# Altium schematic sheet 04_SCAN.SchDoc
size A4; PageSetup: Record=PageOptions|CenterHorizontal=True|CenterVertical=True|PrintScale=0.97|XCorrection=1.00|YCorrection=1.00|PrintKind=0|BorderSize=5000000|LeftOffset=0|BottomOffset=0|Orientation=2|PaperLength=1000|PaperWidth=1000|Scale=100|PaperSource=7|PrintQuality=-4|MediaType=1|DitherType=10|PaperKind=A4|PrintScaleMode=1
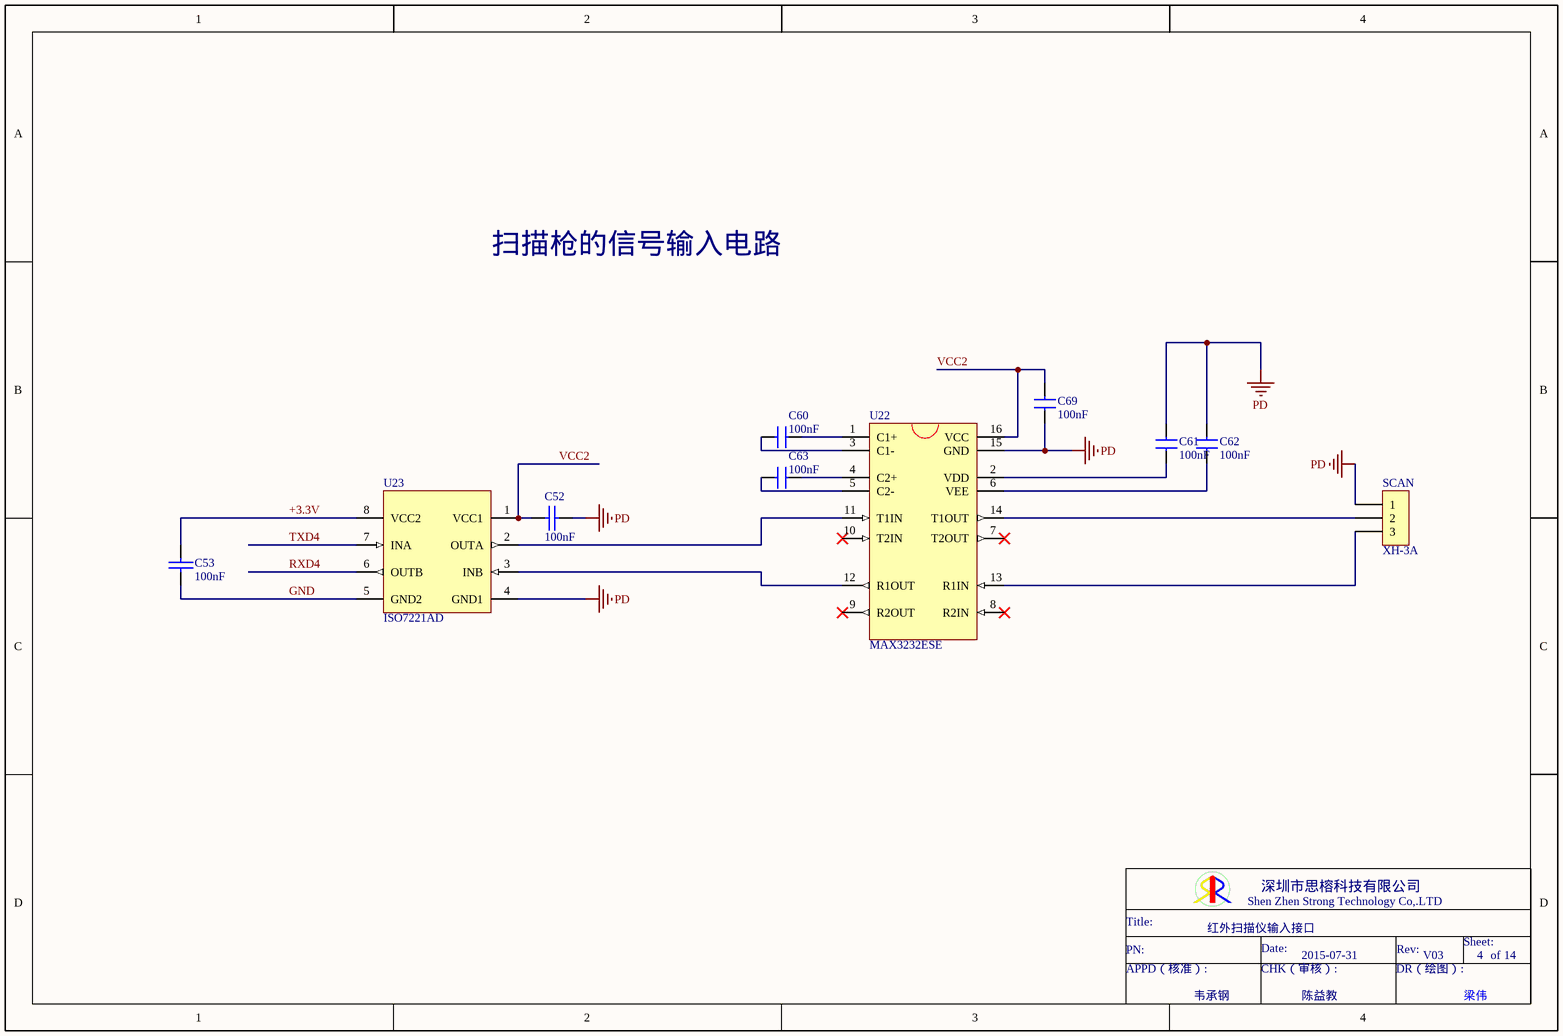
[diagram p0: 04_SCAN.SchDoc]

## Parts
C52  100nF  [0603C]
C53  100nF  [0603C]
C60  100nF  [0603C]
C61  100nF  [0603C]
C62  100nF  [0603C]
C63  100nF  [0603C]
C69  100nF  [0603C]
SCAN  XH-3A  [CN3-2.54]
U22  MAX3232ESE  [SOP16]
U23  ISO7221AD  [SOP8]

## Nets
PD: C52.2 C61.2 C62.2 C69.2 SCAN.1 U22.15(GND) U23.4(GND1)
+3.3V: C53.2 U23.8(VCC2)
GND: C53.1 U23.5(GND2)
RXD4: U23.6(OUTB)
TXD4: U23.7(INA)
VCC2: C52.1 C69.1 U22.16(VCC) U23.1(VCC1)
NetC60_1: C60.1 U22.3(C1-)
NetC60_2: C60.2 U22.1(C1+)
NetC61_1: C61.1 U22.2(VDD)
NetC62_1: C62.1 U22.6(VEE)
NetC63_1: C63.1 U22.4(C2+)
NetC63_2: C63.2 U22.5(C2-)
NetSCAN_2: SCAN.2 U22.14(T1OUT)
NetSCAN_3: SCAN.3 U22.13(R1IN)
NetU22_11: U22.11(T1IN) U23.2(OUTA)
NetU22_12: U22.12(R1OUT) U23.3(INB)

Not connected (* = marked no-connect by the designer): U22 7(T2OUT)* 8(R2IN)* 9(R2OUT)* 10(T2IN)*

## Notes on the sheet
- 扫描枪的信号输入电路
- 红外扫描仪输入接口
- 2015-07-31
- V03
- 4
- 14
- 韦承钢
- 陈益教
- Shen Zhen Strong Technology Co,.LTD
- 深圳市思榕科技有限公司
- Title:
- PN:
- APPD（核准）:
- Date:
- CHK（审核）:
- DR（绘图）:
- Rev:
- Sheet:
- of
- 梁伟

## Library data of the parts
C52 C53 = CAP
C60-C63 C69 = 电容: Capacitor
  C60: C316: 100NF
  C61: C319: 100NF
  C62: C320: 100NF
  C63: C317: 100NF
  C69: C318: 100NF
SCAN = CON3
U22 = U101: SP3232; Published: 8-Jun-2000; LatestRevisionDate: 29-May-2009; LatestRevisionNote: IPC-7351 Footprint Added.; PackageVersion: Aug-1999; PackageReference: SOT-23B; Publisher: Altium Limited; PackageDescription: 3-Pin SOT-23 Package 0.95 mm Pitch, 2.4 mm Lead Span
U23 = Component_1